# EAGLE design BottleBuddy-V1.2 (EAGLE 7.4.0)
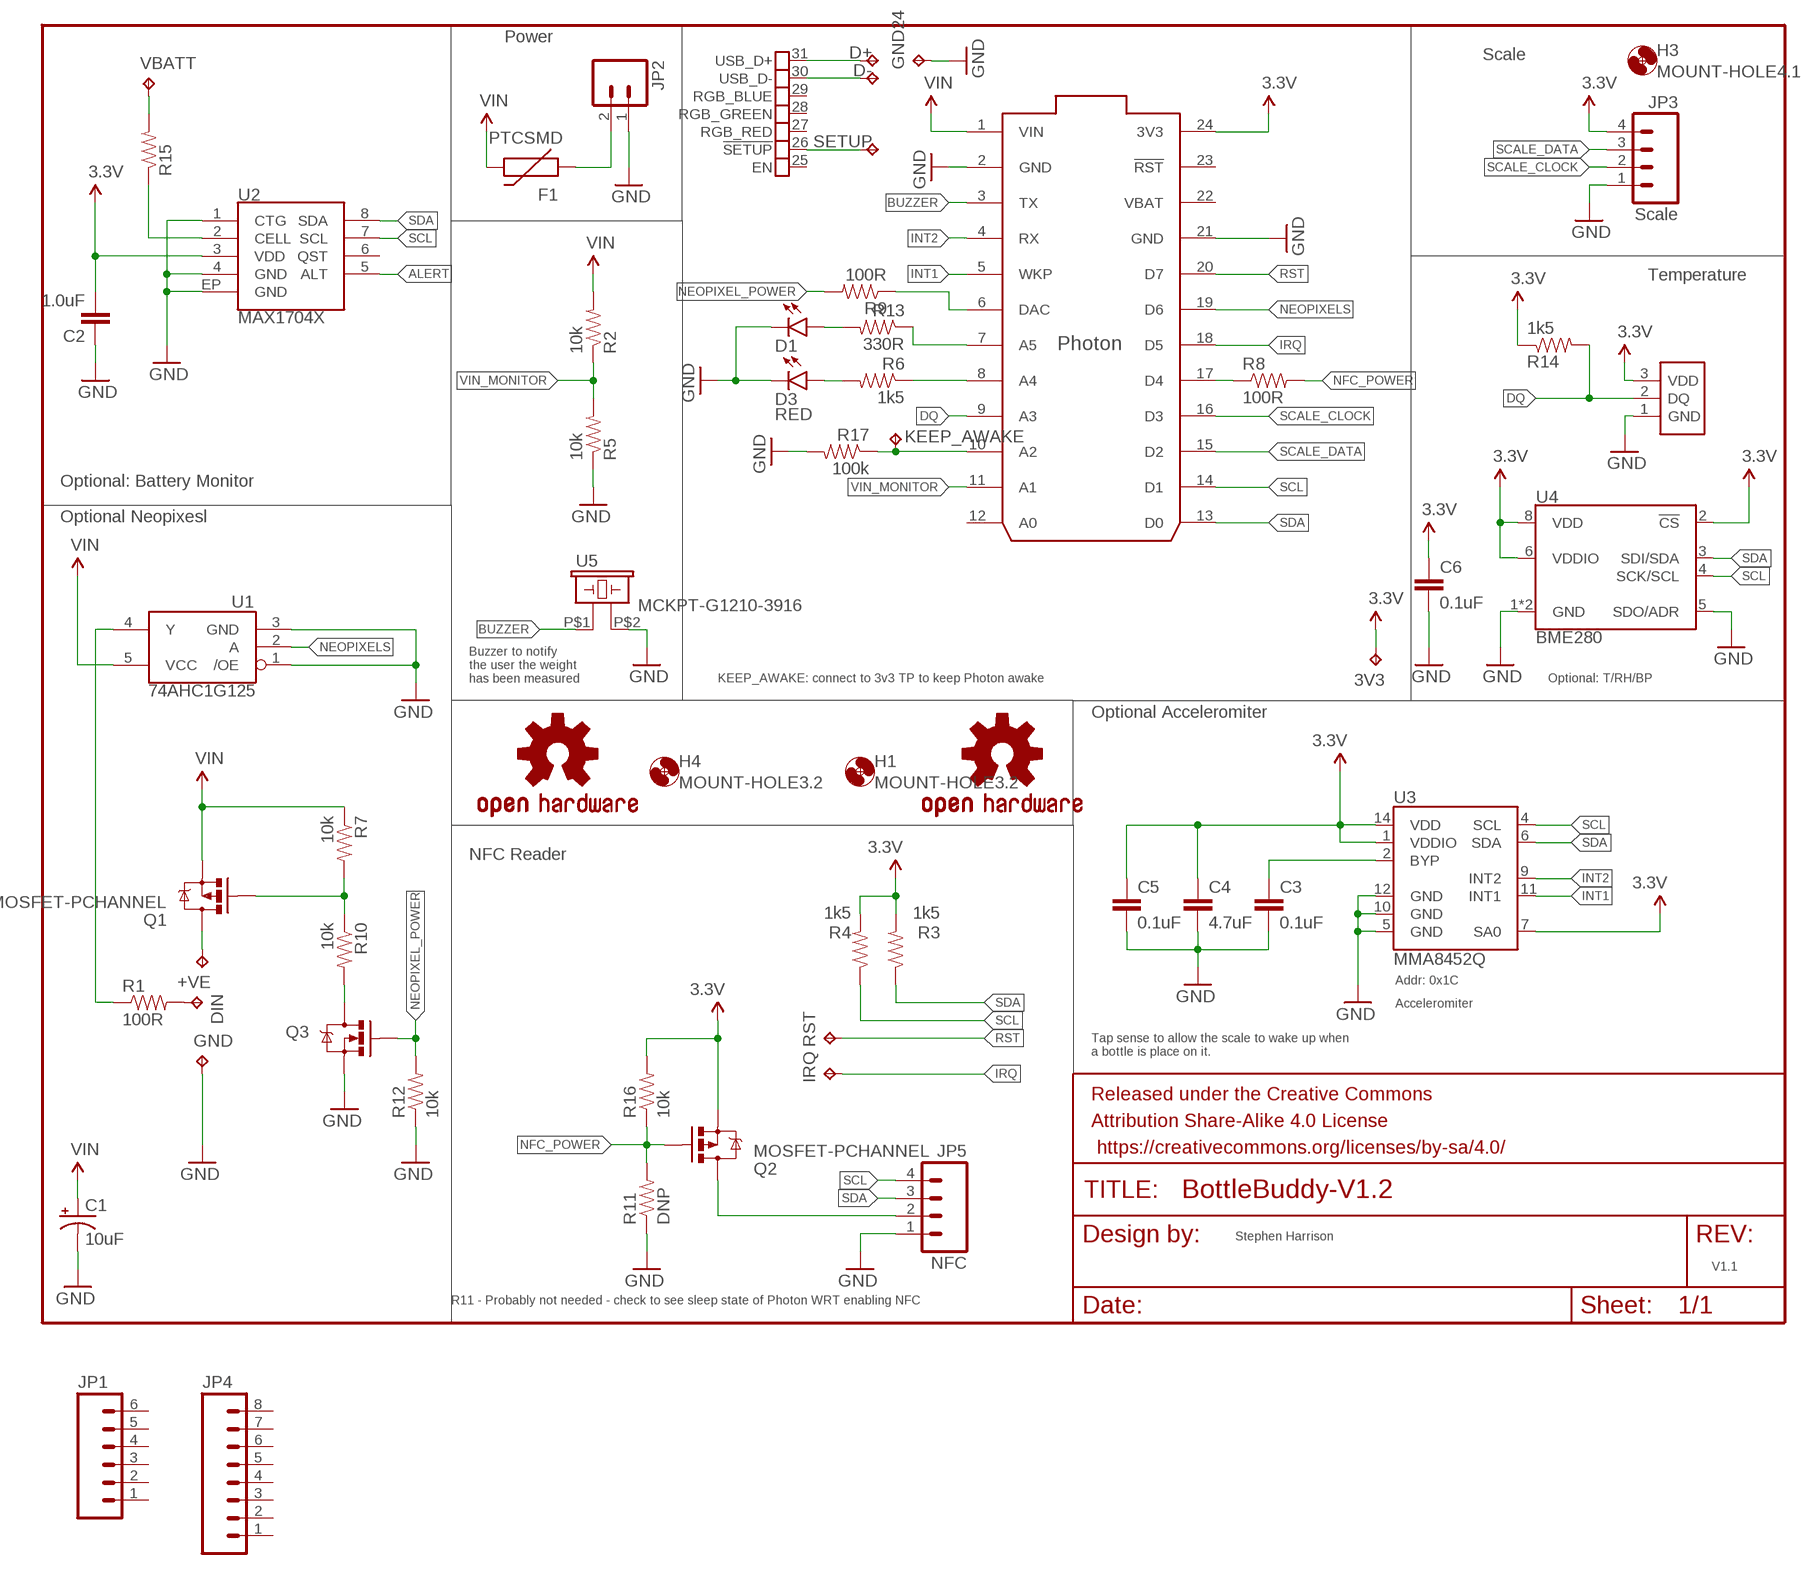
[diagram p0: schematic, sheet 1]

## Parts
3V3  TPTP20R  [TP20R]
+VE  TPTP20R  [TP20R]
C1  10uF  10UF-16V-10%(TANT)  [EIA3216]
C2  1.0uF  1.0UF-25V-+80/-20(0805)"  [0805-CAP]
C3  0.1uF  CAP0805  [0805]
C4  4.7uF  CAP0805  [0805]
C5  0.1uF  CAP0805  [0805]
C6  0.1uF  CAP0805  [0805]
D1  LED1206-BOTTOM  [LED-1206-BOTTOM]
D3  RED  LED1206  [LED-1206]
D+  TPTP20R  [TP20R]
D-  TPTP20R  [TP20R]
DIN  TPTP20R  [TP20R]
F1  PTCSMD  [PTC-1206]
FRAME1  FRAME-LETTER  [CREATIVE_COMMONS]
GND  TPTP20R  [TP20R]
GND24  TPTP20R  [TP20R]
H1  MOUNT-HOLE3.2  [3,2]
H3  MOUNT-HOLE4.1  [4,1]
H4  MOUNT-HOLE3.2  [3,2]
IRQ  NFC IRQ  TPTP20R  [TP20R]
JP1  M06SILK_FEMALE_PTH  [1X06]
JP2  M02-JST-2MM-SMT  [JST-2-SMD]
JP3  Scale  M04PTH  [1X04]
JP4  M08SILK_FEMALE_PTH  [1X08]
JP5  NFC  M04PTH  [1X04]
KEEP_AWAKE  TPTP20R  [TP20R]
LOGO1  OSHW-LOGOL  [OSHW-LOGO-L]
LOGO2  OSHW-LOGOL  [OSHW-LOGO-L]
Q1  MOSFET-PCHANNEL  [SOT23-3]
Q2  MOSFET-PCHANNEL  [SOT23-3]
Q3  200mA/50V  MOSFET-NCHANNELBSS138  [SOT23-3]
R1  100R  RESISTOR1206  [1206]
R2  10k  RESISTOR1206  [1206]
R3  1k5  RESISTOR1206  [1206]
R4  1k5  RESISTOR1206  [1206]
R5  10k  RESISTOR1206  [1206]
R6  1k5  RESISTOR1206  [1206]
R7  10k  RESISTOR1206  [1206]
R8  100R  RESISTOR1206  [1206]
R9  100R  RESISTOR1206  [1206]
R10  10k  RESISTOR1206  [1206]
R11  DNP  RESISTOR1206  [1206]
R12  10k  RESISTOR1206  [1206]
R13  330R  RESISTOR1206  [1206]
R14  1k5  RESISTOR1206  [1206]
R15  RESISTOR1206  [1206]
R16  10k  RESISTOR1206  [1206]
R17  100k  RESISTOR1206  [1206]
RST  TPTP20R  [TP20R]
S1  SENSOR-DS18B20  [TO-92-TRIANGLE]
SETUP  TPTP20R  [TP20R]
U1  74AHC1G125  [SOT23-5]
U2  MAX1704X  [TDFN-8]
U3  MMA8452Q  [QFN-16_0.5MM]
U4  BME280  [LGA-8-2.5X2.5]
U5  MCKPT-G1210-3916  [BUZZER-12MM]
U$1  PHOTON_SMD  [PHOTON_SMD]
VBATT  TPTP20R  [TP20R]

## Nets
3.3V: 3V3.TP C2.2 C4.1 C5.1 C6.1 JP3.4 Q2.2(S) R3.2 R4.2 R14.1 R16.2 S1.3(VDD) U2.3(VDD) U3.1(VDDIO) U3.7(SA0) U3.14(VDD) U4.2(!CS) U4.6(VDDIO) U4.8(VDD) U$1.24(3V3)
ALERT: U2.5(ALT)
BUZZER: U5.P$1 U$1.3(TX)
DQ: R14.2 S1.2(DQ) U$1.9(A3)
GND: C1.C(-) C2.1 C3.2 C4.2 C5.2 C6.2 D1.C D3.C GND24.TP GND.TP JP2.1 JP3.1 JP5.1 Q3.2(S) R5.1 R11.1 R12.1 R17.2 S1.1(GND) U1.1(/OE) U1.3(GND) U2.1(CTG) U2.4(GND) U2.EP(GND) U3.5(GND) U3.10(GND) U3.12(GND) U4.1(GND) U4.5(SDO/ADR) U4.7(GND) U5.P$2 U$1.2(GND) U$1.21(GND)
INT1: U3.11(INT1) U$1.5(WKP)
INT2: U3.9(INT2) U$1.4(RX)
IRQ: IRQ.TP U$1.18(D5)
N$1: Q1.1(G) R7.2 R10.1
N$2: F1.1 JP2.2
N$3: Q3.3(D) R10.2
N$4: JP5.2 Q2.3(D)
N$5: R9.1 U$1.6(DAC)
N$6: +VE.TP Q1.3(D)
N$7: R8.1 U$1.17(D4)
N$8: R6.1 U$1.8(A4)
N$9: D1.A R13.2
N$10: R13.1 U$1.7(A5)
N$11: R15.2 VBATT.TP
N$12: KEEP_AWAKE.TP R17.1 U$1.10(A2)
N$13: D3.A R6.2
N$14: DIN.TP R1.2
N$15: R15.1 U2.2(CELL)
N$16: R1.1 U1.4(Y)
N$17: D+.TP U$1.31(USB_D+)
N$18: C3.1 U3.2(BYP)
N$19: D-.TP U$1.30(USB_D-)
NEOPIXEL_POWER: Q3.1(G) R9.2 R12.2
NEOPIXELS: U1.2(A) U$1.19(D6)
NFC_POWER: Q2.1(G) R8.2 R11.2 R16.1
RST: RST.TP U$1.20(D7)
SCALE_CLOCK: JP3.2 U$1.16(D3)
SCALE_DATA: JP3.3 U$1.15(D2)
SCL: JP5.4 R4.1 U2.7(SCL) U3.4(SCL) U4.4(SCK/SCL) U$1.14(D1)
SDA: JP5.3 R3.1 U2.8(SDA) U3.6(SDA) U4.3(SDI/SDA) U$1.13(D0)
SETUP: SETUP.TP U$1.26(!SETUP)
VIN: C1.A(+) F1.2 Q1.2(S) R2.2 R7.1 U1.5(VCC) U$1.1(VIN)
VIN_MONITOR: R2.1 R5.2 U$1.11(A1)
Unconnected: JP1.1 JP1.2 JP1.3 JP1.4 JP1.5 JP1.6 JP4.1 JP4.2 JP4.3 JP4.4 JP4.5 JP4.6 JP4.7 JP4.8 U2.6(QST) U$1.12(A0) U$1.23(!RST) U$1.25(EN) U$1.27(RGB_RED) U$1.28(RGB_GREEN) U$1.29(RGB_BLUE)

## Notes on the sheet
- Power
- Scale
- Temperature
- Optional: Battery Monitor
- Optional Neopixesl
- Buzzer to notify
  the user the weight
  has been measured
- KEEP_AWAKE: connect to 3v3 TP to keep Photon awake | Optional: T/RH/BP
- Optional Acceleromiter
- NFC Reader
- Addr: 0x1C
- Acceleromiter
- Tap sense to allow the scale to wake up when
  a bottle is place on it.
- Stephen Harrison
- V1.1
- R11 - Probably not needed - check to see sleep state of Photon WRT enabling NFC

## Power pins joined to a net without a drawn wire
VBAT: U$1.22(VBAT)

## Library data of the parts
3V3 +VE D+ D- DIN GND GND24 IRQ KEEP_AWAKE RST SETUP VBATT = testpad:TP: Test pad
C1 = SparkFun-Capacitors:10UF-16V-10%(TANT): CAP-00811 1206/EIA-3216 Tantalum capacitor; PROD_ID: CAP-00811
C2 = SparkFun-Capacitors:1.0UF-25V-+80/-20(0805): CAP-11625; PROD_ID: CAP-11625
C3-C6 = SparkFun-Capacitors:CAP: Capacitor Standard 0603 ceramic capacitor, and 0.1" leaded capacitor.
D1 D3 = SparkFun-LED:LED: LEDs Standard schematic elements and footprints for 5mm, 3mm, 1206, and 0603 sized LEDs. 5mm - Spark Fun Electronics SKU : COM-00529 (and others)
F1 = SparkFun-PowerIC:PTC: Resettable Fuse PTC Resettable Fuse. Spark Fun Electronics SKU : COM-08357; PROD_ID: RES-11150
FRAME1 = SparkFun-Aesthetics:FRAME-LETTER: Schematic Frame Standard 8.5x11 US Letter frame
H1 H3 H4 = holes:MOUNT-HOLE: MOUNTING HOLE with drill center marker
JP1 = SparkFun-Connectors:M06: Header 6 Standard 6-pin 0.1" header. Use with straight break away headers (SKU : PRT-00116), right angle break away headers (PRT-00553), swiss pins (PRT-00743), machine pins (PRT-00117), and female headers (PRT-00115). Molex polarized connector foot print use with SKU : PRT-08094 with associated crimp pins and housings. NOTES ON THE VARIANTS LOCK and LOCK_LONGPADS... This footprint was designed to help hold the alignment of a through-hole component (i.e. 6-pin header) while soldering it into place. You may notice that each hole has been shifted either up or down by 0.005 of an inch from it's more standard position (which is a perfectly straight line). This slight alteration caused the pins (the squares in the middle) to touch the edges of the holes. Because they are alternating, it causes a "brace" to hold the component in place. 0.005 has proven to be the perfect amount of "off-center" position when using our standard breakaway headers. Although looks a little odd when you look at the bare footprint, once you have a header in there, the alteration is very hard to notice. Also,if you push a header all the way into place, it is covered up entirely on the bottom side. This idea of altering the position of holes to aid alignment will be further integrated into the Sparkfun Library for other footprints. It can help hold any component with 3 or more connection pins.; PROD_ID: CONN-08437
JP2 = SparkFun-Connectors:M02: Standard 2-pin 0.1" header. Use with - straight break away headers ( PRT-00116) - right angle break away headers (PRT-00553) - swiss pins (PRT-00743) - machine pins (PRT-00117) - female headers (PRT-00115) Molex polarized connector foot print use with: PRT-08233 with associated crimp pins and housings. 2.54_SCREWTERM for use with PRT-10571. 3.5mm Screw Terminal footprints for PRT-08084 5mm Screw Terminal footprints for use with PRT-08432; PROD_ID: CONN-11443
JP3 JP5 = SparkFun-Connectors:M04: Header 4 Standard 4-pin 0.1" header. Use with straight break away headers (SKU : PRT-00116), right angle break away headers (PRT-00553), swiss pins (PRT-00743), machine pins (PRT-00117), and female headers (PRT-00115). Molex polarized connector foot print use with SKU : PRT-08231 with associated crimp pins and housings. 1MM SMD Version SKU: PRT-10208
JP4 = SparkFun-Connectors:M08: Header 8 Standard 8-pin 0.1" header. Use with straight break away headers (SKU : PRT-00116), right angle break away headers (PRT-00553), swiss pins (PRT-00743), machine pins (PRT-00117), and female headers (PRT-00115).; PROD_ID: CONN-08438
LOGO1 LOGO2 = SparkFun-Aesthetics:OSHW-LOGO: Open Source Hardware Logo This logo indicates the piece of hardware it is found on incorporates a OSHW license and/or adheres to the definition of open source hardware found here: http://freedomdefined.org/OSHW
Q1 Q2 = SparkFun-DiscreteSemi:MOSFET-PCHANNEL: Generic PMOSFET IRLML2244 - TRANS-11153 (SOT-23 -20V -4.3A) (1.Gate 2.Source 3.Drain) FQP27P06 - COM-10349 <http://www.sparkfun.com/products/10349> (TO-220 -60V -27A) (1.Gate 2.Source 3.Drain); PROD_ID: TRANS-08285
Q3 = SparkFun-DiscreteSemi:MOSFET-NCHANNEL: Common NMOSFET Parts MFG P/N Store ID Prod ID FDD8780 TRANS-09984 SI7820DN TRANS-11055 FDS6630A IC-08089 2N7002PW TRANS-11151 FQP30N06L COM-10213 TRANS-10060 BSS123LT1G TRANS-08345 BSS138 TRANS-00830 BS170 2N7000; PROD_ID: TRANS-00830
R1-R17 = SparkFun-Resistors:RESISTOR: Resistor Basic schematic elements and footprints for 0603, 1206, and PTH resistors.
S1 = SENSOR-DS18B20:SENSOR-DS18B20
U1 = SparkFun-DigitalIC:74AHC1G125: Single bus buffer gate with 3-state output; PROD_ID: IC-11920
U2 = SparkFun-PowerIC:MAX1704X: MAX17043/MAX17044: Battery Fuel Guage (43 is 1cell, 44 is 2cell); PROD-ID: IC-10399
U3 = SparkFun-Sensors:MMA8452Q: MMA8452Q 3-Axis, 12/8-bit Digital Accelerometer Supply Voltage: 1.6-3.6V Range: +/- 2g, 4g, 8g Interface: I2C, 12-bit and 8-bit ODR: 1.56 Hz - 800 Hz Package: QFN-16 http://cache.freescale.com/files/sensors/doc/data_sheet/MMA8452Q.pdf; PROD_ID: IC-10769
U4 = SparkFun-Sensors:BME280: Bosch BME280 – Combined Humidity and Pressure Sensor The BME280 is as combined digital humidity, pressure and temperature sensor based on proven sensing principles. The sensor module is housed in an extremely compact metal-lid LGA package with a footprint of only 2.5×2.5mm² with a height of 0.93mm. Its small dimensions and its low power consumption allow the implementation in battery driven devices such as handsets, GPS modules or watches. Datasheet <https://cdn.sparkfun.com/assets/learn_tutorials/4/1/9/BST-BME280_DS001-10.pdf> SparkFun Products SparkFun Atmospheric Sensor Breakout - BME280 <https://www.sparkfun.com/products/13676> (SEN-13676); PROD_ID: IC-13090
U5 = Tinamous:MCKPT-G1210-3916
U$1 = Tinamous:PHOTON_SMD: Photon (without headers) - designed to be surface mounted with 7 extra exposed pads on the bottom of the board which include, 3 RGB LED outputs, /SETUP, EN (3.3V SMPS enable input), USB D+ and USB D-.

## Board
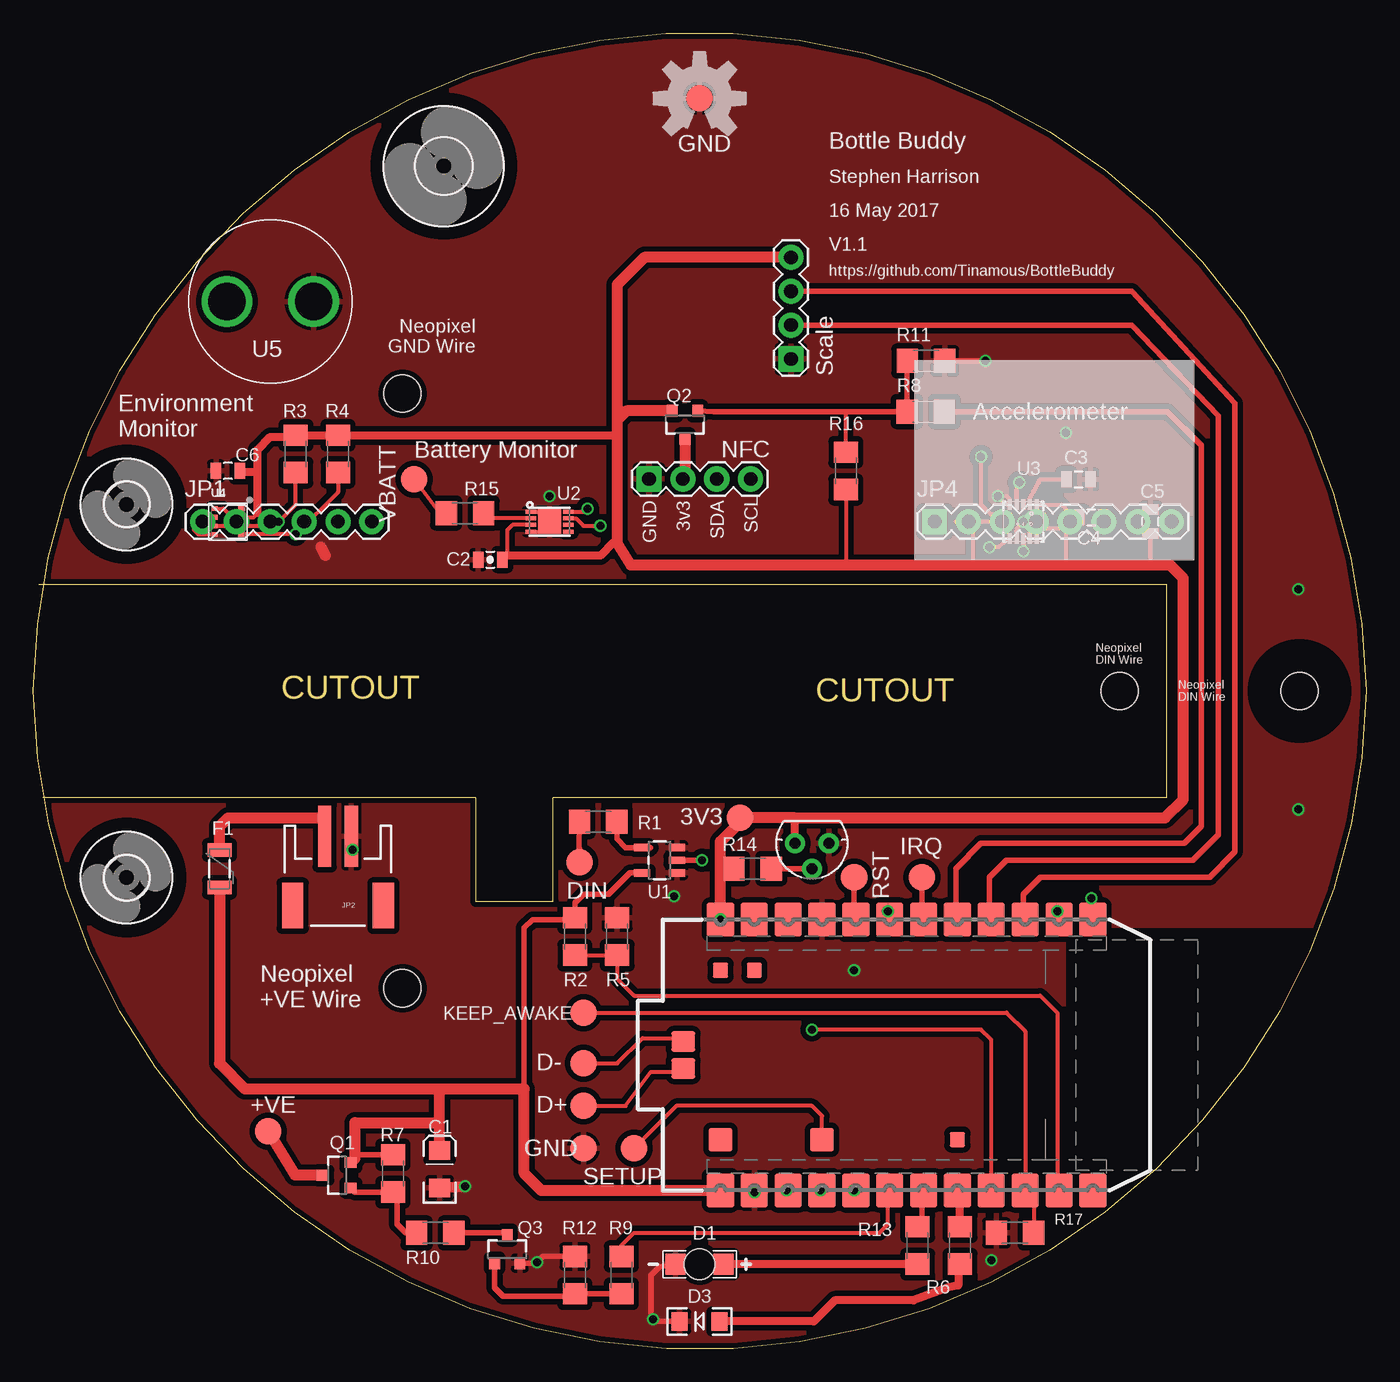
[diagram p1: board, top side]
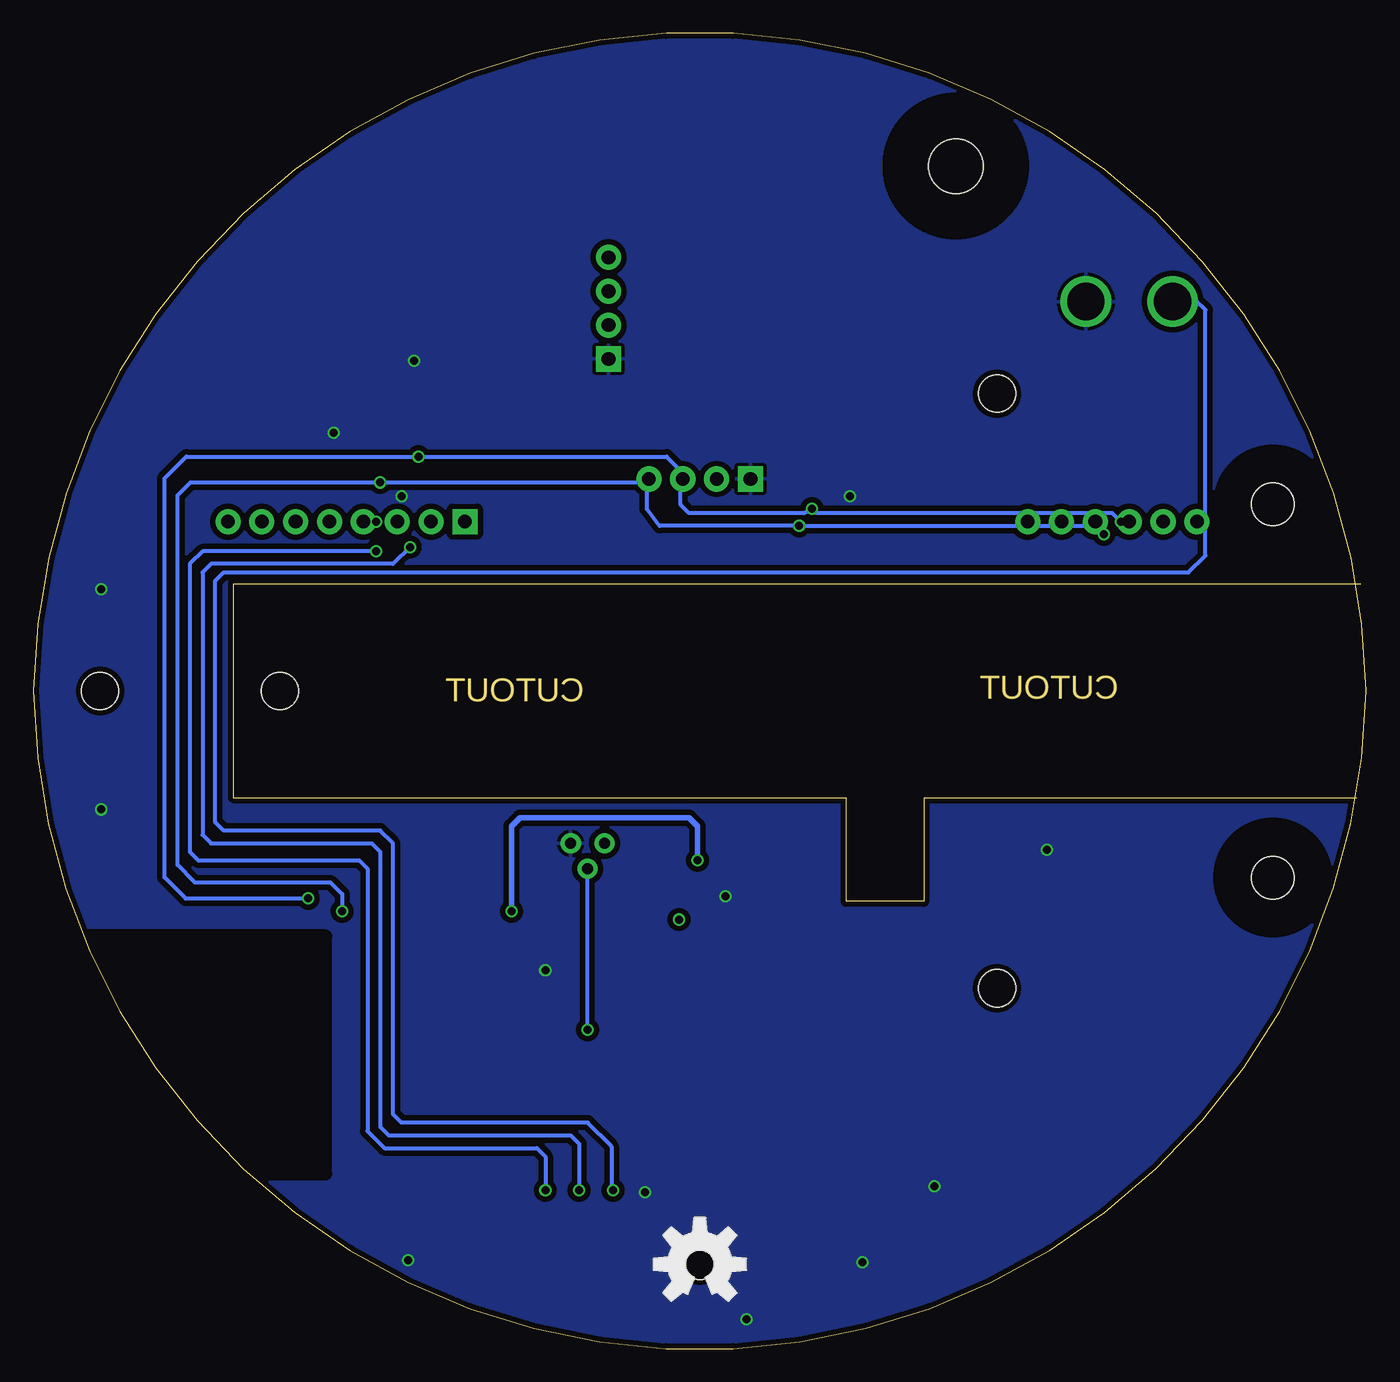
[diagram p2: board, bottom side, seen from below]

Size 100.01 x 98.66 mm. Coordinates in mm from the lower left corner, seen from the top.
Outline: 100,49.33 arc179 0,49.33 0.01,49.33 arc179 100.01,49.33
Outline: 0.4,57.33 85,57.33 85,41.33 39,41.33 39,33.55 33.2,33.55 33.2,41.33 0.7,41.33
Copper layers (1*16): Top 0.035mm / dielectric 1.5mm / Bottom 0.035mm
Design rules "dirt_cheap_dirty_boards.v1": minimum track width 5mil, minimum drill 12mil, track to track 5mil, track to pad 5mil, pad to pad 5mil, via to via 5mil, smd to smd 0mil, copper to edge 10mil, drill to drill 10mil, minimum pad ring 10mil, minimum via ring 6mil, stop-mask expansion 2mil, vias tented up to drill 25mil, thermal gap 10mil
Holes 2.8 mm at 81.5,49.33 27.7,71.63 27.7,27.03 95,49.33
tRestrict: area 78.1,13.1 to 98.4,30.9; area 91.8,46.2 to 98.2,52.5
bRestrict: area 78.1,13.1 to 98.4,30.9

### Footprints (pad centres in the part's own frame; a part is rotated, then mirrored left to right if it is on the bottom)
TP20R = smd 2 x 2: TP 0,0
EIA3216 = smd 1.4 x 1.6: A 1.4,0; C -1.4,0
0805-CAP = smd 0.8 x 1.2: 1 -0.9,0; 2 0.9,0
0805 = smd 0.8 x 1.2: 1 -0.9,0; 2 0.9,0
LED-1206-BOTTOM = smd 1.5 x 1.6: A -1.8,0; C 1.8,0 | hole 2.3: 0,0
LED-1206 = smd 1.2 x 1.4: A -1.5,0; C 1.5,0
PTC-1206 = smd 1 x 1.8: 1 -1.4,0; 2 1.4,0
3,2 = hole 3.2: 0,0
4,1 = hole 4.1: 0,0
1X06 = drill 1.016 pad 1.88: 1 0,0; 2 2.54,0; 3 5.08,0; 4 7.62,0; 5 10.16,0; 6 12.7,0
JST-2-SMD = smd 1 x 4.6: 1 -1,-3.7; 2 1,-3.7 | smd 1.6 x 3.4: NC1 -3.4,1.5; NC2 3.4,1.5
1X04 = drill 1.016 pad 1.88 square: 1 0,0 | drill 1.016 pad 1.88: 2 2.54,0; 3 5.08,0; 4 7.62,0
1X08 = drill 1.016 pad 1.88 square: 1 0,0 | drill 1.016 pad 1.88: 2 2.54,0; 3 5.08,0; 4 7.62,0; 5 10.16,0; 6 12.7,0; 7 15.24,0; 8 17.78,0
SOT23-3 = smd 0.8 x 0.9: 1 -0.95,-1; 2 0.95,-1; 3 0,1.1
1206 = smd 1.6 x 1.8: 1 -1.4,0; 2 1.4,0
TO-92-TRIANGLE = drill 0.813 pad 1.524: 1 -1.27,0; 2 0,1.905; 3 1.27,0
SOT23-5 = smd 0.55 x 1.2: 1 -0.95,-1.3; 2 0,-1.3; 3 0.95,-1.3; 4 0.95,1.3; 5 -0.95,1.3
TDFN-8 = smd 0.8 x 0.3: 1 -1.4,0.75; 2 -1.4,0.25; 3 -1.4,-0.25; 4 -1.4,-0.75; 5 1.4,-0.75; 6 1.4,-0.25; 7 1.4,0.25; 8 1.4,0.75 | smd 1.73 x 1.88: EP 0,0
QFN-16_0.5MM = smd 0.8 x 0.3: 1 -1.275,1; 2 -1.275,0.5; 3 -1.275,0; 4 -1.275,-0.5; 5 -1.275,-1; 9 1.275,-1; 10 1.275,-0.5; 11 1.275,0; 12 1.275,0.5; 13 1.275,1 | smd 0.3 x 0.8: 6 -0.5,-1.275; 7 0,-1.275; 8 0.5,-1.275; 14 0.5,1.275; 15 0,1.275; 16 -0.5,1.275
LGA-8-2.5X2.5 = smd 0.35 x 0.5: 1 -0.975,1.025; 2 -0.325,1.025; 3 0.325,1.025; 4 0.975,1.025; 5 0.975,-1.025; 6 0.325,-1.025; 7 -0.325,-1.025; 8 -0.975,-1.025
BUZZER-12MM = drill 2.8: P$1 -3.25,0; P$2 3.25,0
PHOTON_SMD = smd 2.54 x 2.032: 1 0,32.258; 2 0,29.718; 3 0,27.178; 4 0,24.638; 5 0,22.098; 6 0,19.558; 7 0,17.018; 8 0,14.478; 9 0,11.938; 10 0,9.398; 11 0,6.858; 12 0,4.318; 13 20.32,4.318; 14 20.32,6.858; 15 20.32,9.398; 16 20.32,11.938; 17 20.32,14.478; 18 20.32,17.018; 19 20.32,19.558; 20 20.32,22.098; 21 20.32,24.638; 22 20.32,27.178; 23 20.32,29.718; 24 20.32,32.258 | smd 1.778 x 1.778: 25 3.81,32.258; 26 3.81,24.638 | smd 1.143 x 1.143: 27 3.81,14.478; 28 16.51,29.718; 29 16.51,32.258 | smd 1.524 x 1.778: 30 11.176,35.052; 31 9.144,35.052

### Placement (x,y rotation side)
3V3  53.02,39.8 0 top
+VE  17.62,16.29 0 top
C1  30.48,13.45 90 top
C2  34.29,59.17 0 top
C3  78.42,65.2 0 top
C4  79.38,62.35 0 top
C5  83.82,62.03 90 top
C6  14.61,65.84 180 top
D1  50,6.33 180 top
D3  50,2.03 180 top
D+  41.27,18.21 0 top
D-  41.27,21.39 0 top
DIN  41,36.47 0 top
F1  13.97,35.99 270 top
FRAME1  18.7,-10.82 0 top  (outside the outline)
GND  50,93.78 0 top
GND24  41.27,15.04 0 top
H1  7,35.33 0 top
H3  30.8,88.7 0 top
H4  7,63.33 0 top
IRQ  66.67,35.36 0 top
JP1  12.7,62.03 0 top
JP2  22.86,34.72 180 top
JP3  56.85,74.23 90 top
JP4  67.63,62.03 0 top
JP5  46.2,65.23 0 top
KEEP_AWAKE  41.27,25.2 0 top
LOGO1  50,6.33 0 bottom
LOGO2  50,93.78 0 top
Q1  22.82,13 90 top
Q2  48.9,69.33 180 top
Q3  35.56,7.42 0 top
R1  42.38,39.52 180 top
R2  40.64,30.91 90 top
R3  19.68,67.11 90 top
R4  22.86,67.11 90 top
R5  43.81,30.91 270 top
R6  69.53,7.74 270 top
R7  26.99,13.13 270 top
R8  66.96,70.28 180 top
R9  44.13,5.51 270 top
R10  30.16,8.69 0 top
R11  66.99,74.09 180 top
R12  40.64,5.51 270 top
R13  66.36,7.74 270 top
R14  53.98,35.99 0 top
R15  32.38,62.66 180 top
R16  60.96,65.84 270 top
R17  73.66,8.69 180 top
RST  61.59,35.36 0 top
S1  58.42,37.9 180 top
SETUP  45.09,15.04 0 top
U1  46.99,36.63 90 top
U2  38.73,62.03 0 top
U3  74.3,62.03 270 top
U4  14.61,62.03 270 top
U5  17.78,78.54 0 top
U$1  83.82,11.86 90 top
VBATT  28.57,65.2 0 top

### Tracks (layer width: path | path; a pad name or v marks a point on that pad's centre or on a via)
3.3V  (via drill 0.6)
  Top 0.305: U2.3 35.95,61.78 35.56,61.39 35.56,59.49 34.92,59.17 C2.2 | C5.1 83.82,58.77 | 43.69,69.46 43.77,69.18 43.81,69.01 | U3.14 77.33,61.53 77.47,61.39 | 77.47,61.39 77.47,58.77 | U3.7 71.12,62.03 70.48,61.39 70.48,58.77 | U3.1 77.15,63.3 77.47,62.98 77.47,62.03 | 77.47,62.03 77.47,61.39 | C4.1 77.79,62.35 77.47,62.03 | R16.2 60.96,58.77 | 16.83,62.66 16.52,62.35 U4.2 14.61,62.35 | 15.56,65.78 C6.1 | U4.8 14.27,63 14.61,62.66 14.61,62.35 | U4.6 14.6,61.7 14.61,61.71 14.61,62.35 | 3V3.TP 51.44,38.21 51.75,38.21
  Top 0.61: 43.81,60.44 43.5,60.44 42.55,59.49 35.56,59.49 | 16.83,62.66 16.83,65.84 | 16.83,65.84 16.83,67.43 17.78,68.38 19.55,68.38 R3.2 R4.2 43.73,68.51 43.77,69.18 | 15.56,65.78 16.77,65.78 16.83,65.84 | S1.3 57.15,39.81 | 57.15,39.81 | R14.1 51.56,35.99
  Top 0.813: v51.56,32.18 51.56,35.99 51.56,38.02 51.75,38.21 53.35,39.81 57.15,39.81 84.92,39.81 86.29,41.18 86.29,57.8 85.32,58.77 83.82,58.77 77.47,58.77 70.48,58.77 60.96,58.77 44.85,58.77 43.81,60.44 43.81,69.01 43.81,69.65 | JP3.4 45.86,81.85 43.81,79.81 43.81,69.65 | Q2.2 44.5,70.33 43.81,69.65
BUZZER  (via drill 0.6)
  Top 0.305: v56.52,11.86 56.52,11.74 arc-180 U$1.3
  Bottom 0.305: U5.P$1 12.7,78.54 12.06,77.9 12.06,59.49 13.34,58.22 85.72,58.22 86.36,57.58 86.36,39.49 85.72,38.85 73.98,38.85 73.03,37.9 73.03,17.58 72.39,16.94 58.42,16.94 56.64,15.16 56.64,11.67 v56.52,11.86
DQ  (via drill 0.6)
  Top 0.305: U$1.9 71.88,23.17 71.12,23.93 v58.42,23.93
  Top 0.406: R14.2 S1.2
  Bottom 0.305: v58.42,23.93 S1.2
GND  (via drill 0.6)
  Top 0.305: 69.58,61.66 69.22,62.03 | U2.4 37.98,61.28 U2.EP 37.98,62.78 U2.1 | U3.10 73.8,61.53 v74.3,62.03 74.8,61.53 U3.12 | 73.03,63.93 73.3,63.66 U3.5 73.02,63.3 v72.39,63.93 | U4.5 12.4,61.05 12.06,61.39 12.06,62.03 12.39,62.35 U4.7
  Top 0.406: D3.C 46.64,2.03 v46.49,2.19 46.35,2.32 46.35,5.51 46.99,6.15 D1.C | 54.74,12.49 U$1.2 54.11,11.85 v54.11,11.71 | Q3.2 37.51,6.42 v37.78,6.47 38.23,6.91 R12.1 | 59.19,32.19 U$1.21 | R5.1 43.63,32.95 | v71.44,74.09 R11.1
  Top 0.813: 21.59,60.12 21.91,59.49 | C1.C v32.38,12.18
  other vias: 61.59,28.37 94.93,56.95 94.93,40.44 23.95,37.43 48.08,33.94 77.47,68.7 38.73,63.93 71.89,6.63
  pour Bottom (isolate 0.406, rank 5): -1,48.53 -0.9,70.53 26.3,97.63 36.8,97.63 39.8,100.63 62.1,100.63 66.2,96.53 74.3,96.53 101.4,69.43 100.6,29.63 73.9,-1.97 28.5,-0.87 4.4,17.23
  pour Top (isolate 0.406): -1.27,109.02 105.41,109.02 110.49,103.94 110.49,8.05 95.25,-7.19 13.97,-7.19 -15.88,22.66 -15.88,94.41
INT1  (via drill 0.6)
  Top 0.305: U3.11 v74.3,59.8 | v61.59,11.86 61.59,11.74 U$1.5
  Bottom 0.305: v74.3,59.8 87.31,59.8 88.27,58.85 88.27,37.26 87.63,36.63 75.56,36.63 74.93,35.99 74.93,16.31 73.66,15.04 62.23,15.04 61.59,14.4 v61.59,11.86
INT2  (via drill 0.6)
  Top 0.305: U3.9 72.39,60.12 v71.75,60.12 | v59.05,11.86 59.05,11.74 U$1.4
  Bottom 0.305: v71.75,60.12 73.03,58.85 86.68,58.85 87.31,58.22 87.31,38.53 86.68,37.9 74.61,37.9 73.98,37.26 73.98,16.62 73.34,15.99 59.69,15.99 59.05,15.36 v59.05,11.86
IRQ
  Top 0.406: IRQ.TP 66.67,32.31 U$1.18
N$1
  Top 0.406: R10.1 27.94,8.69 27.3,9.32 27.3,11.41 R7.2 24.14,11.73 Q1.1
N$2
  Top 0.813: F1.1 13.97,39.17 14.61,39.8 21.75,39.8 JP2.2
N$3
  Top 0.406: R10.2 35.39,8.69 Q3.3
N$4
  Top 0.813: Q2.3 48.9,65.07 JP5.2
N$5
  Top 0.305: R9.1 44.13,7.73 45.09,8.69 63.5,8.69 64.14,9.32 64.14,11.74 U$1.6
N$6
  Top 0.813: Q1.3 19.64,13 +VE.TP
N$7
  Top 0.406: R8.1 85.09,70.28 87.63,67.74 87.63,39.17 86.36,37.9 71.12,37.9 69.22,35.99 69.22,32.31 U$1.17
N$8
  Top 0.406: 69.22,11.74 U$1.8
  Top 0.61: R6.1 69.53,11.67 U$1.8
N$9
  Top 0.61: R13.2 D1.A
N$10
  Top 0.406: R13.1 66.36,9.32 66.67,9.32 66.67,11.74 U$1.7
N$11
  Top 0.305: VBATT.TP 30.48,62.66 R15.2
N$12
  Top 0.305: KEEP_AWAKE.TP 73.03,25.2 74.42,23.8 U$1.10 75.06,11.22 R17.1
N$13
  Top 0.61: R6.2 69.4,6.34 69.4,4.75 68.58,4.56 66.04,3.61 60.15,3.61 58.57,2.03 D3.A
N$14
  Top 0.406: DIN.TP 41.16,36.94 40.95,37.58 R1.2
N$15
  Top 0.305: U2.2 34.03,62.28 R15.1
N$16
  Top 0.406: R1.1 43.78,38.25 44.45,37.58 46.32,37.58 U1.4
N$17
  Top 0.305: D+.TP 44.45,18.21 46.35,20.75 48.51,20.75 U$1.31
N$18
  Top 0.305: U3.2 74.8,63.8 75.56,65.2 C3.1
N$19
  Top 0.305: D-.TP 43.81,21.39 45.72,23.29 48.51,23.29 U$1.30
NEOPIXEL_POWER
  Top 0.406: Q3.1 34.61,4.88 34.61,4.56 35.24,3.92 40.45,3.92 R12.2 R9.2
NEOPIXELS  (via drill 0.6)
  Top 0.406: v64.14,32.82 64.14,32.31 U$1.19 | U1.2 v50.16,36.63
  Bottom 0.406: v50.16,36.63 50.16,39.17 50.8,39.8 63.5,39.8 64.14,39.17 v64.14,32.82
NFC_POWER
  Top 0.305: R16.1 60.96,70.28
  Top 0.406: Q2.1 51.07,70.28 60.96,70.28 R8.2 65.56,74.07 R11.2
RST
  Top 0.406: RST.TP 61.59,32.31 U$1.20
SCALE_CLOCK
  Top 0.406: JP3.2 82.41,76.77 88.9,69.96 88.9,38.53 87,36.63 73.03,36.63 71.75,35.36 71.75,32.31 U$1.16
SCALE_DATA
  Top 0.406: JP3.3 82.41,79.31 90.17,70.92 90.17,37.26 88.27,35.36 75.56,35.36 74.3,34.09 74.3,33.58 U$1.15
SCL  (via drill 0.6)
  Top 0.305: U2.7 40.71,62.28 41.27,61.71 v42.55,61.71 | U3.4 73.8,64.46 v73.98,64.96 | U4.4 15.65,61.08 v19.68,61.08 22.86,64.25 R4.1
  Top 0.406: v76.83,32.82 76.83,32.31 U$1.14 | 53.84,65.2 JP5.4
  Bottom 0.305: v76.83,32.82 76.83,34.09 77.72,34.98 87.89,34.98 89.19,36.28 89.19,63.99 88.21,64.96 v73.98,64.96 54.08,64.96 JP5.4 53.98,64.76 53.98,62.98 53.02,61.71 v42.55,61.71 20.32,61.71 v19.68,61.08
SDA  (via drill 0.6)
  Top 0.305: U2.8 41.39,62.78 v41.59,62.98 | U3.6 71.89,62.53 71.12,63.3 v71.12,66.9 | U4.3 18.09,61.7 v18.41,62.03 19.68,63.3 R3.1 19.55,66.34
  Top 0.406: v79.38,33.77 79.38,32.31 U$1.13
  Bottom 0.305: v79.38,33.77 88.58,33.77 90.17,35.35 90.17,65.27 88.54,66.9 v71.12,66.9 52.5,66.9 51.44,65.84 51.44,65.38 JP5.3 51.44,65.07 51.44,63.3 50.8,62.66 42.23,62.66 v41.59,62.98 41.27,62.66 19.05,62.66 v18.41,62.03
SETUP
  Top 0.305: U$1.26 59.18,17.45 58.42,18.21 48.26,18.21 SETUP.TP
VIN
  Top 0.406: R7.1 24.4,14.53 24.13,14.26 | U1.5 44.77,35.68 43.18,34.09 41.27,34.09 40.64,33.45 R2.2 40.51,32.18 37.47,32.18 36.83,31.55 36.83,30.28 36.83,19.48
  Top 0.813: 50.93,11.23 U$1.1 38.1,11.86 36.83,13.13 36.83,19.48 30.48,19.48 | Q1.2 24.13,14.26 24.13,16.94 30.48,16.94 | 30.48,15.04 C1.A 30.48,16.94 | F1.2 13.97,21.39 15.88,19.48 30.48,19.48 | 30.48,16.94 30.48,19.48
VIN_MONITOR
  Top 0.305: 76.83,11.99 76.83,25.2 75.56,26.47 45.09,26.47 43.81,27.74 R5.2 R2.1
  Top 0.406: 76.83,11.99 U$1.11

### Text on the board
Dimension: CUTOUT | CUTOUT
tPlace: Neopixel / DIN Wire | Neopixel / DIN Wire
tNames: Bottle Buddy | Stephen Harrison | 16 May 2017 | V1.1 | https://github.com/Tinamous/BottleBuddy | Neopixel / GND Wire | Accelerometer | Environment / Monitor | Battery Monitor | SCL | GND | 3v3 | SDA | Neopixel / +VE Wire | GND